# EAGLE design DasAltimeter V0.1 (EAGLE 8.5.0)
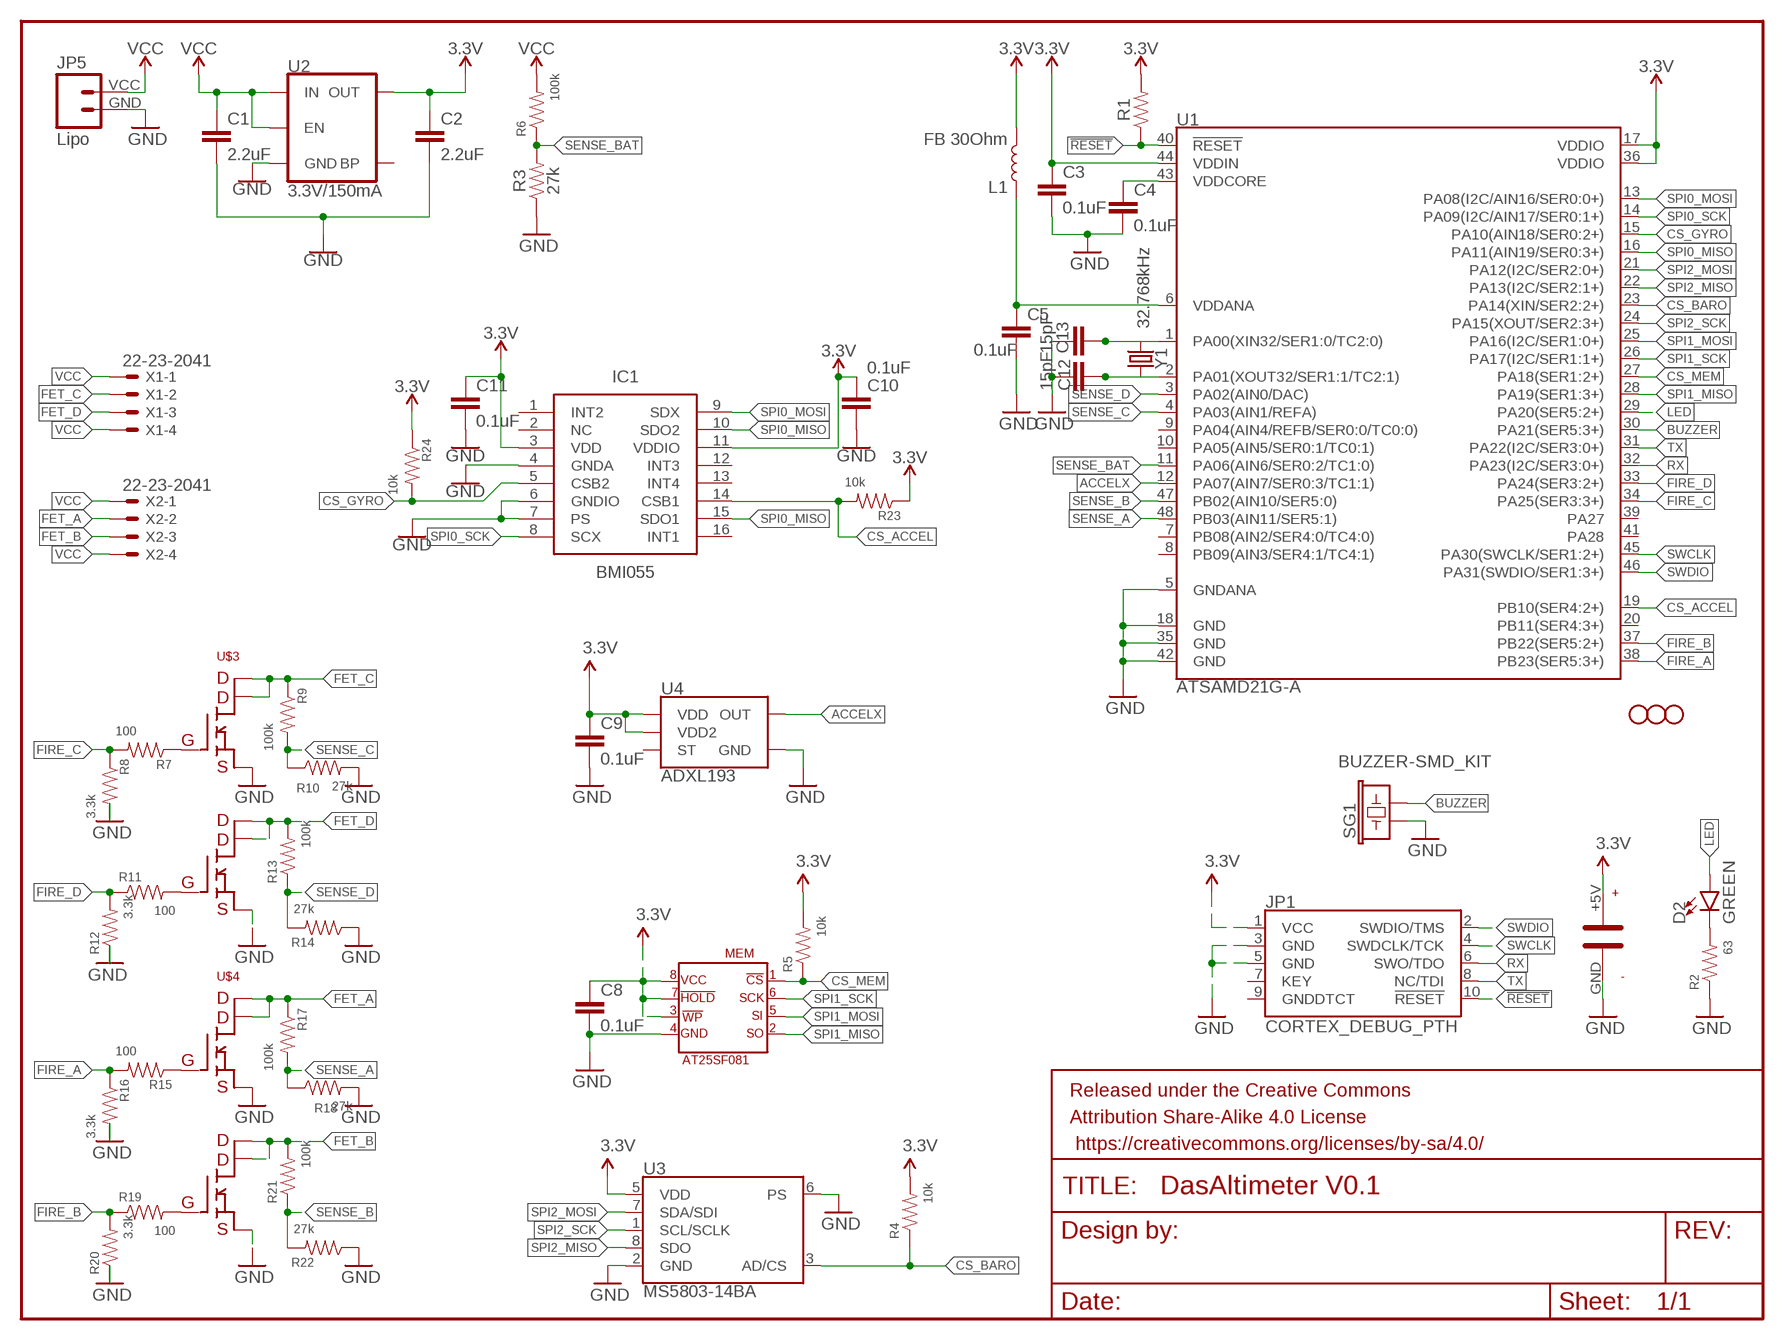
[diagram p0: schematic, sheet 1]

## Parts
C1  2.2uF  2.2UF-0603-10V-20%  [0603]
C2  2.2uF  2.2UF-0603-10V-20%  [0603]
C3  0.1uF  0.1UF-0402-16V-10%  [0402]
C4  0.1uF  0.1UF-0402-16V-10%  [0402]
C5  0.1uF  0.1UF-0402-16V-10%  [0402]
C8  0.1uF  0.1UF-0402-16V-10%  [0402]
C9  0.1uF  0.1UF-0402-16V-10%  [0402]
C10  0.1uF  0.1UF-0402-16V-10%  [0402]
C11  0.1uF  0.1UF-0402-16V-10%  [0402]
C12  15pF  15PF-0402-50V-5%  [0402]
C13  15pF  15PF-0402-50V-5%  [0402]
D2  GREEN  LED-GREEN1206  [LED-1206]
FRAME1  FRAME-LETTERNO_PACKAGE  [DUMMY]
H1  STAND-OFFTIGHT  [STAND-OFF-TIGHT]
H2  STAND-OFFTIGHT  [STAND-OFF-TIGHT]
H3  STAND-OFFTIGHT  [STAND-OFF-TIGHT]
IC1  BMI055  [BMI055]
JP1  CORTEX_DEBUG_PTH  [2X5-PTH-1.27MM]
JP5  Lipo  M024UCON-15767  [JST-2-SMD-VERT]
L1  FB 30Ohm  INDUCTOR-0603-33NH  [0603]
MEM  AT25SF081  [AT25SF081]
R1  RESISTOR0402  [0402]
R2  63  RESISTOR0402  [0402]
R3  27k  RESISTOR0402  [0402]
R4  10k  RESISTOR0402  [0402]
R5  10k  RESISTOR0402  [0402]
R6  100k  RESISTOR0402  [0402]
R7  100  RESISTOR0402  [0402]
R8  3.3k  RESISTOR0402  [0402]
R9  100k  RESISTOR0402  [0402]
R10  27k  RESISTOR0402  [0402]
R11  100  RESISTOR0402  [0402]
R12  3.3k  RESISTOR0402  [0402]
R13  100k  RESISTOR0402  [0402]
R14  27k  RESISTOR0402  [0402]
R15  100  RESISTOR0402  [0402]
R16  3.3k  RESISTOR0402  [0402]
R17  100k  RESISTOR0402  [0402]
R18  27k  RESISTOR0402  [0402]
R19  100  RESISTOR0402  [0402]
R20  3.3k  RESISTOR0402  [0402]
R21  100k  RESISTOR0402  [0402]
R22  27k  RESISTOR0402  [0402]
R23  10k  RESISTOR0402  [0402]
R24  10k  RESISTOR0402  [0402]
SG1  BUZZER-SMD_KIT  [BUZZER-CCV-KIT]
U1  ATSAMD21G-A  [TQFP-48]
U2  3.3V/150mA  V_REG_MIC52053.3V  [SOT23-5]
U3  MS5803-14BA  [MS5803]
U4  ADXL193  [LCC-8]
U$1  PB-5R0H104-R  [PB-5R0H104-R]
U$3  SI7232DN  [SI7232DN]
U$4  SI7232DN  [SI7232DN]
X1  22-23-2041  [22-23-2041]
X2  22-23-2041  [22-23-2041]
Y1  32.768kHz  CRYSTAL-32.768KHZSMD-3.2X1.5  [CRYSTAL-SMD-3.2X1.5MM]

## Nets
3.3V: C2.1 C3.1 C8.1 C9.1 C10.1 C11.1 IC1.3(VDD) IC1.11(VDDIO) JP1.1(VCC) L1.2 MEM.!HOLD MEM.!WP MEM.VCC R1.2 R4.2 R5.2 R23.1 R24.1 U1.17(VDDIO) U1.36(VDDIO) U1.44(VDDIN) U2.5(OUT) U3.5(VDD) U4.P$7(VDD) U4.P$8(VDD2) U$1.+5V
!RESET: JP1.10(!RESET) R1.1 U1.40(!RESET!)
ACCELX: U1.12(PA07(AIN7/SER0:3/TC1:1)) U4.P$6(OUT)
BUZZER: SG1.- U1.30(PA21(SER5:3+))
CS_ACCEL: IC1.14(CSB1) R23.2 U1.19(PB10(SER4:2+))
CS_BARO: R4.1 U1.23(PA14(XIN/SER2:2+)) U3.3(AD/CS)
CS_GYRO: IC1.5(CSB2) R24.2 U1.15(PA10(AIN18/SER0:2+))
CS_MEM: MEM.!CS R5.1 U1.27(PA18(SER1:2+))
FET_A: R17.1 U$4.7(PIN7) U$4.8(PIN8) U$4.9(PIN8) X2.2
FET_B: R21.2 U$4.5(PIN5) U$4.6(PIN6) U$4.10(PIN5) X2.3
FET_C: R9.1 U$3.7(PIN7) U$3.8(PIN8) U$3.9(PIN8) X1.2
FET_D: R13.2 U$3.5(PIN5) U$3.6(PIN6) U$3.10(PIN5) X1.3
FIRE_A: R15.2 R16.1 U1.38(PB23(SER5:3+))
FIRE_B: R19.1 R20.2 U1.37(PB22(SER5:2+))
FIRE_C: R7.2 R8.1 U1.34(PA25(SER3:3+))
FIRE_D: R11.1 R12.2 U1.33(PA24(SER3:2+))
GND: C1.2 C2.2 C3.2 C4.2 C5.2 C8.2 C9.2 C10.2 C11.2 C12.1 C13.1 IC1.4(GNDA) IC1.6(GNDIO) IC1.7(PS) JP1.3(GND) JP1.5(GND) JP5.GND MEM.GND R2.1 R3.1 R8.2 R10.2 R12.1 R14.1 R16.2 R18.2 R20.1 R22.1 SG1.+ U1.5(GNDANA) U1.18(GND) U1.35(GND) U1.42(GND) U2.2(GND) U3.2(GND) U3.6(PS) U4.P$3(GND) U$1.GND U$3.1(PIN1) U$3.3(PIN3) U$4.1(PIN1) U$4.3(PIN3)
LED: D2.A U1.29(PA20(SER5:2+))
N$1: R7.1 U$3.2(PIN2)
N$3: C4.1 U1.43(VDDCORE)
N$4: C5.1 L1.1 U1.6(VDDANA)
N$5: C13.2 U1.1(PA00(XIN32/SER1:0/TC2:0)) Y1.P$2
N$6: C12.2 U1.2(PA01(XOUT32/SER1:1/TC2:1)) Y1.P$1
N$8: R11.2 U$3.4(PIN4)
N$12: R15.1 U$4.2(PIN2)
N$13: R19.2 U$4.4(PIN4)
N$29: D2.C R2.2
RX: JP1.6(SWO/TDO) U1.32(PA23(I2C/SER3:0+))
SENSE_A: R17.2 R18.1 U1.48(PB03(AIN11/SER5:1))
SENSE_B: R21.1 R22.2 U1.47(PB02(AIN10/SER5:0))
SENSE_BAT: R3.2 R6.1 U1.11(PA06(AIN6/SER0:2/TC1:0))
SENSE_C: R9.2 R10.1 U1.4(PA03(AIN1/REFA))
SENSE_D: R13.1 R14.2 U1.3(PA02(AIN0/DAC))
SPI0_MISO: IC1.10(SDO2) IC1.15(SDO1) U1.16(PA11(AIN19/SER0:3+))
SPI0_MOSI: IC1.9(SDX) U1.13(PA08(I2C/AIN16/SER0:0+))
SPI0_SCK: IC1.8(SCX) U1.14(PA09(I2C/AIN17/SER0:1+))
SPI1_MISO: MEM.SO U1.28(PA19(SER1:3+))
SPI1_MOSI: MEM.SI U1.25(PA16(I2C/SER1:0+))
SPI1_SCK: MEM.SCK U1.26(PA17(I2C/SER1:1+))
SPI2_MISO: U1.22(PA13(I2C/SER2:1+)) U3.8(SDO)
SPI2_MOSI: U1.21(PA12(I2C/SER2:0+)) U3.7(SDA/SDI)
SPI2_SCK: U1.24(PA15(XOUT/SER2:3+)) U3.1(SCL/SCLK)
SWCLK: JP1.4(SWDCLK/TCK) U1.45(PA30(SWCLK/SER1:2+))
SWDIO: JP1.2(SWDIO/TMS) U1.46(PA31(SWDIO/SER1:3+))
TX: JP1.8(NC/TDI) U1.31(PA22(I2C/SER3:0+))
VCC: C1.1 JP5.VCC R6.2 U2.1(IN) U2.3(EN) X1.1 X1.4 X2.1 X2.4
Unconnected: IC1.1(INT2) IC1.2(NC) IC1.12(INT3) IC1.13(INT4) IC1.16(INT1) JP1.7(KEY) JP1.9(GNDDTCT) U1.7(PB08(AIN2/SER4:0/TC4:0)) U1.8(PB09(AIN3/SER4:1/TC4:1)) U1.9(PA04(AIN4/REFB/SER0:0/TC0:0)) U1.10(PA05(AIN5/SER0:1/TC0:1)) U1.20(PB11(SER4:3+)) U1.39(PA27) U1.41(PA28) U2.4(BP) U4.P$4(ST)

## Library data of the parts
C1 C2 = SparkFun-Capacitors:2.2UF: 2.2µF ceramic capacitors A capacitor is a passive two-terminal electrical component used to store electrical energy temporarily in an electric field.; PROD_ID: CAP-07888
C3-C5 C8-C11 = SparkFun-Capacitors:0.1UF: 0.1µF ceramic capacitors A capacitor is a passive two-terminal electrical component used to store electrical energy temporarily in an electric field.; PROD_ID: CAP-12416
C12 C13 = SparkFun-Capacitors:15PF: 15pF ceramic capacitors A capacitor is a passive two-terminal electrical component used to store electrical energy temporarily in an electric field.; PROD_ID: CAP-13063
D2 = SparkFun-LED:LED-GREEN: Green SMD LED Used in manufacturing of various products at SparkFun Packages: 0603 - SMD 0603 package [Product Link] <http://www.futureelectronics.com/en/technologies/semiconductors/optoelectronics/leds/Pages/9894312-LTST-C190GKT.aspx?CrossPart=HSMG-C190&IM=0> LilyPad 1206 - SMD1206 LilyPad package [Product Link] <http://www.futureelectronics.com/en/Technologies/Product.aspx?ProductID=IN150NGHARVATEKCORPORATION2049943&IM=0> 1206 - SMD1206 package [Product Link] <http://www.futureelectronics.com/en/technologies/semiconductors/optoelectronics/leds/Pages/8315665-LTST-C150KGKT.aspx?IM=0> 1206 Bottom Mount -SMD 1206 Bottom Mount [Product Link] <http://www.digikey.com/product-detail/en/lite-on-inc/LTST-C230KGKT/160-1456-1-ND/386854> SparkFun Products: Pro Mini 328 -5V <https://www.sparkfun.com/products/821> RedBoard <https://www.sparkfun.com/products/12757> MP3 Trigger <https://www.sparkfun.com/products/13720> Makey Makey <https://www.sparkfun.com/products/11076>; PROD_ID: DIO-00862
FRAME1 = SparkFun-Aesthetics:FRAME-LETTER: Schematic Frame - Letter Standard 8.5x11 US Letter frame; DESIGNER: Nobody; VERSION: v01
H1-H3 = SparkFun-Hardware:STAND-OFF: Stand Off Drill holes for mechanically mounting via screws, standoffs, etc. Note: Use the keepout ring to avoid running the screw head into surrounding components. Variant Overviews STAND-OFF - Mechanical footprint for a #4 phillips button head screw. STAND-OFF-TIGHT - Mechanical footprint for a #4 phillips button head screw, Example SparkFun Products Screw - Phillips Head (1/4", 4-40, 10 pack) <https://www.sparkfun.com/products/10453> (PRT-10453) Screw - Phillips Head (1/2", 4-40, 10 pack) <https://www.sparkfun.com/products/10452> (PRT-10452) Screw - Phillips Head (3/4", 4-40, 10 pack) <https://www.sparkfun.com/products/10451> (PRT-10451) Screw - Phillips Head (1", 4-40, 10 pack) <https://www.sparkfun.com/products/10450> (PRT-10450)
IC1 = BMI055:BMI055: IMUs - Inertial Measurement Units 6-Axis Inertia 3x4.5mm LGA-16 <https://componentsearchengine.com/Images/1/BMI055.jpg> Source: Datasheet <https://ae-bst.resource.bosch.com/media/_tech/media/datasheets/BST-BMI055-DS000-08.pdf>; DESCRIPTION: IMUs - Inertial Measurement Units 6-Axis Inertia 3x4.5mm LGA-16; HEIGHT: mm; MANUFACTURER_NAME: Bosch Sensortec; MANUFACTURER_PART_NUMBER: BMI055; SUPPLIER_NAME: RS
JP1 = SparkFun-Connectors:CORTEX_DEBUG: Cortex Debug Connector - 10 pin Supports JTAG debug, Serial Wire debug, and Serial Wire Viewer. PTH and SMD connector options available. General Connector Information <http://infocenter.arm.com/help/topic/com.arm.doc.faqs/attached/13634/cortex_debug_connectors.pdf> Products: PTH Connector <http://www.digikey.com/product-detail/en/cnc-tech/3220-10-0100-00/1175-1627-ND/3883661> -via Digi-Key SparkFun PSoc <https://www.sparkfun.com/products/13229> SparkFun T <https://www.sparkfun.com/products/13810>
JP5 = SparkFun-Connectors:M02: Standard 2-pin 0.1" header. Use with - straight break away headers ( PRT-00116) - right angle break away headers (PRT-00553) - swiss pins (PRT-00743) - machine pins (PRT-00117) - female headers (PRT-00115) Molex polarized connector foot print use with: PRT-08233 with associated crimp pins and housings. 2.54_SCREWTERM for use with PRT-10571. 3.5mm Screw Terminal footprints for PRT-08084 5mm Screw Terminal footprints for use with PRT-08432
L1 = SparkFun-Coils:INDUCTOR: Inductors Resist changes in electrical current. Basically a coil of wire. SparkFun Products: SparkFun Load Cell Amplifier - HX711 <https://www.sparkfun.com/products/13879> IOIO-OTG - V2.2 <https://www.sparkfun.com/products/13613>; PROD_ID: NDUC-07874; VALUE: 33nH/±5%/500mA
MEM = SaL-lib:AT25SF081: AT25SF081 - 8M memory smd
R1-R24 = SparkFun-Resistors:RESISTOR: Generic Resistor Package
SG1 = SparkFun-Electromechanical:BUZZER: Buzzer Small round buzzers that operate around the audible 2kHz range. You can use these as speakers to create simple music or user interfaces. Variant Overview: PTH - Mini Speaker - PC Mount 12mm 2.048kHz <https://www.sparkfun.com/products/7950> PTH_KIT - Mini Speaker - PC Mount 12mm 2.048kHz <https://www.sparkfun.com/products/7950> KIT simplifies soldering by adding stop mask to one side of the pads. PTH_NO_SILK - Mini Speaker - PC Mount 12mm 2.048kHz <https://www.sparkfun.com/products/7950> No silkscreen indicator of buzzer outline. PTH_KIT_NO_SILK - Mini Speaker - PC Mount 12mm 2.048kHz <https://www.sparkfun.com/products/7950> KIT package w/o silkscreen SMD - Buzzer Audio Magnetic (CCV-084B16) SMD buzzer used on, e.g. the LilyPad Buzzer <https://www.sparkfun.com/products/8463> and RFID USB Reader <https://www.sparkfun.com/products/9963>. SMD_KIT - Buzzer Audio Magnetic (CCV-084B16) SMD Buzzer with elongated pins to make soldering easier. Used on the SparkFun Simon Says - Surface Mount Soldering Kit <https://www.sparkfun.com/products/10935>.; PROD_ID: COMP-08568
U1 = SparkFun-IC-Microcontroller:ATSAMD21G: Atmel SAMD21G SMART ARM-Based Microcontroller The Atmel ® | SMART ™ SAM D21 is a series of low-power microcontrollers using the 32-bit ARM ® Cortex ® -M0+ processor, and ranging from 32- to 64-pins with up to 256KB Flash and 32KB of SRAM. The SAM D21 devices operate at a maximum frequency of 48MHz and reach 2.46 CoreMark/MHz. They are designed for simple and intuitive migration with identical peripheral modules, hex compatible code, identical linear address map and pin compatible migration paths between all devices in the product series. All devices include intelligent and flexible peripherals, Atmel Event System for inter-peripheral signaling, and support for capacitive touch button, slider and wheel user interfaces. Datasheet <https://cdn.sparkfun.com/datasheets/Dev/Arduino/Boards/Atmel-42181-SAM-D21_Datasheet.pdf> SparkFun Products SparkFun SAMD21 Mini Breakout <https://www.sparkfun.com/products/13664> (DEV-13664) SparkFun SAMD21 Dev Breakout <https://www.sparkfun.com/products/13672> (DEV-13672); PROD_ID: IC-13064
U2 = SparkFun-IC-Power:V_REG_MIC5205: V_REG MIC5205 Standard 3.3V, 5V, and Adjustable 150mA LDO voltage regulator in SOT-23 layout. Micrel part MIC5205. BP (by-pass) pin is used to lower output noise with 470pF cap, may be left open. On the adjustable version BP is used to set output.; PROD_ID: VREG-00822
U3 = SparkFun-Sensors:MS5803-14BA: Measurement Specialties MS5803_14BA Pressure (Depth) Sensor The MS5803-14BA is a new generation of high resolution pressure sensors with SPI and I2C bus interface. It is optimized for depth measurement systems with a water depth resolution of 1cm and below. The sensor module includes a high linear pressure sensor and an ultra low power 24 bit ΔΣ ADC with internal factory calibrated coefficients. It provides a precise digital 24 Bit pressure and temperature value and different operation modes that allow the user to optimize for conversion speed and current consumption. Datasheet <https://cdn.sparkfun.com/datasheets/Sensors/Weather/ms5803_14ba.pdf> SparkFun Products SparkFun Pressure Sensor Breakout - MS5803-14BA <https://www.sparkfun.com/products/12909> (SEN-12909); PROD_ID: IC-12111
U4 = SparkFun-Sensors:ADXL193: Analog Devices ADXL193 - 250g Accelerometer w/ Analog Output The ADXL193 is a small (5 mm x 5 mm x 2 mm ceramic LCC package), low power (1.5 mA current at 5V), single axis high-g iMEMS® accelerometer designed to sense shock and vibration at g-ranges of ±120g or ±250g. Three models are available and include AD22282-A-R2 (±120g) and AD22283-B-R2 (±250g). These products are used in a variety of crash/impact detection applications which include automotive airbag crash detection systems as well as medical, industrial, and sports equipment. Datasheet <https://www.sparkfun.com/datasheets/Sensors/Accelerometer/ADXL193.pdf> SparkFun Products SparkFun Single Axis Accelerometer Breakout - ADXL193 (+/-250g) <https://www.sparkfun.com/products/9332> (SEN-09332); PROD_ID: IC-09219
U$1 = SaL-lib1:PB-5R0H104-R
U$3 U$4 = SaL-lib1:SI7232DN: SI7232DN dual
X1 X2 = con-molex:22-23-2041: .100" (2.54mm) Center Header - 4 Pin; MF: MOLEX; MPN: 22-23-2041; OC_FARNELL: 1462920; OC_NEWARK: 38C0355
Y1 = SparkFun-Clocks:CRYSTAL-32.768KHZ: 32.768kHz Crystal Frequency: 32.768kHz Frequency Stability: ±20ppm Load Capacitance: 12.5pF (PTH-2X6 & SMD-3.2X1.5), 6pF (SMD-2X6) SparkFun Products: SparkFun BigTime Watch Kit <https://www.sparkfun.com/products/11734> SparkFun nRF52832 Breakout <https://www.sparkfun.com/products/13990> SparkFun Real Time Clock Module <https://www.sparkfun.com/products/12708>; PROD_ID: XTAL-13062

## Board
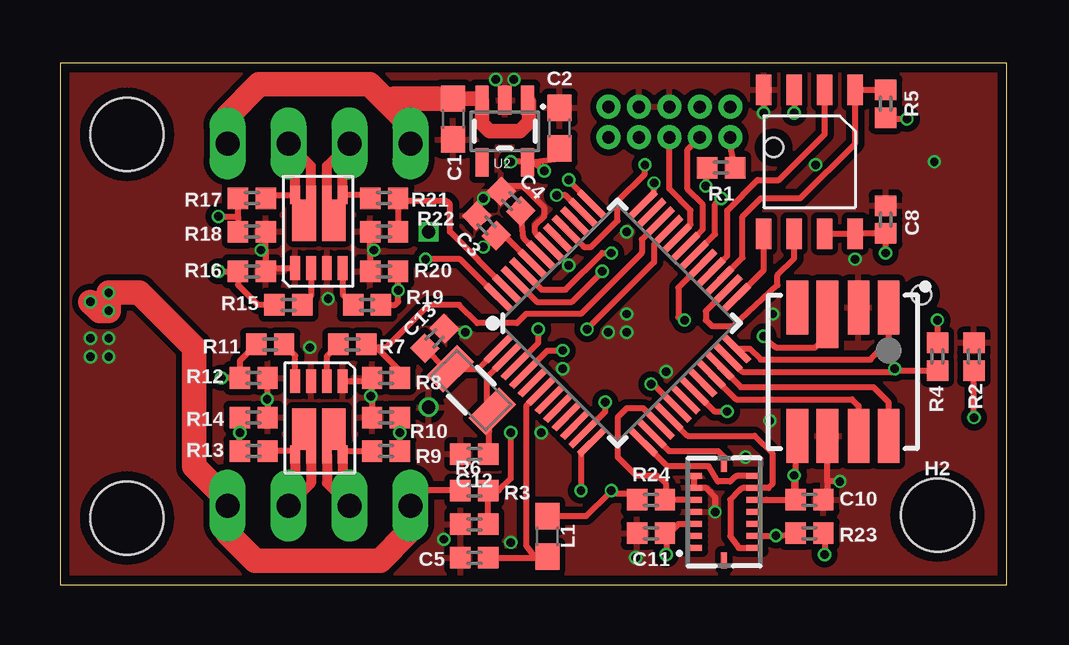
[diagram p1: board, top side]
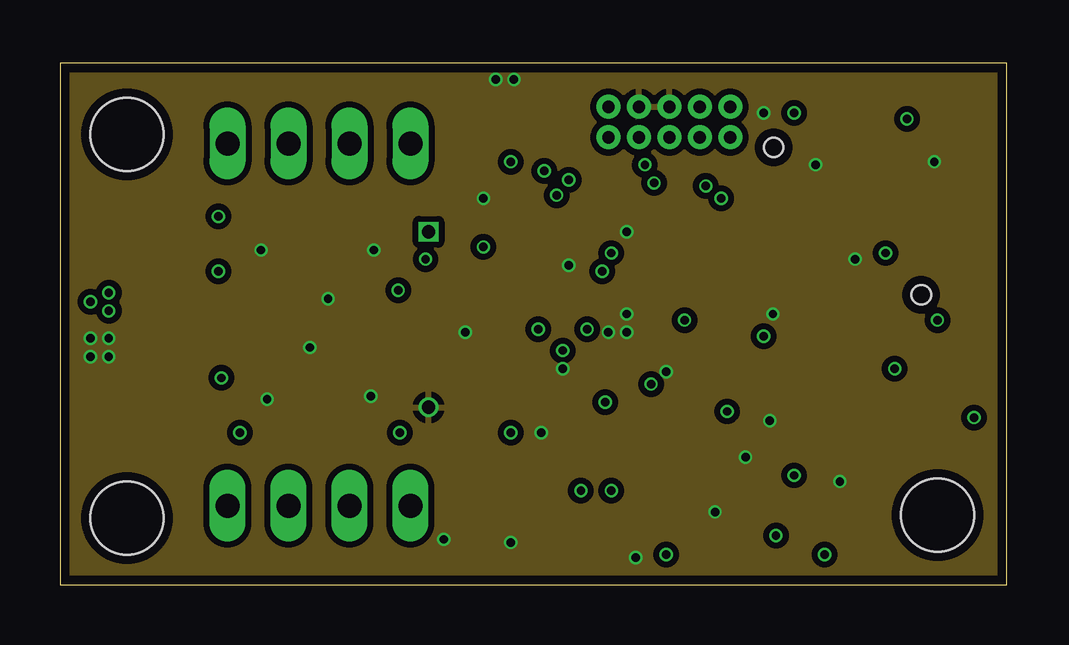
[diagram p2: board, inner layer Route2]
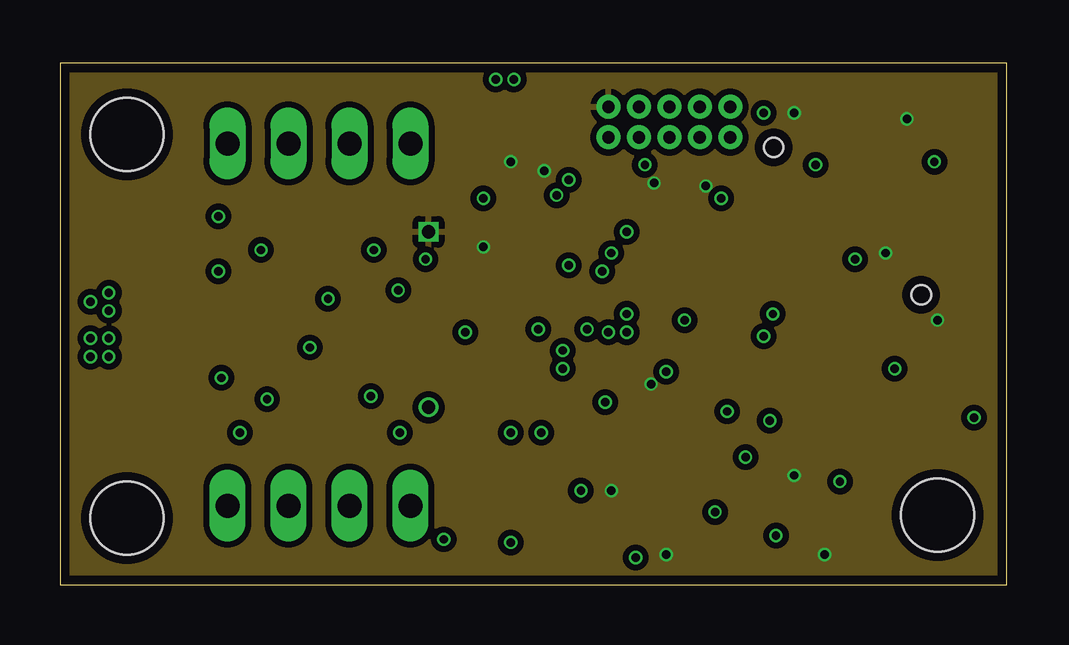
[diagram p3: board, inner layer Route15]
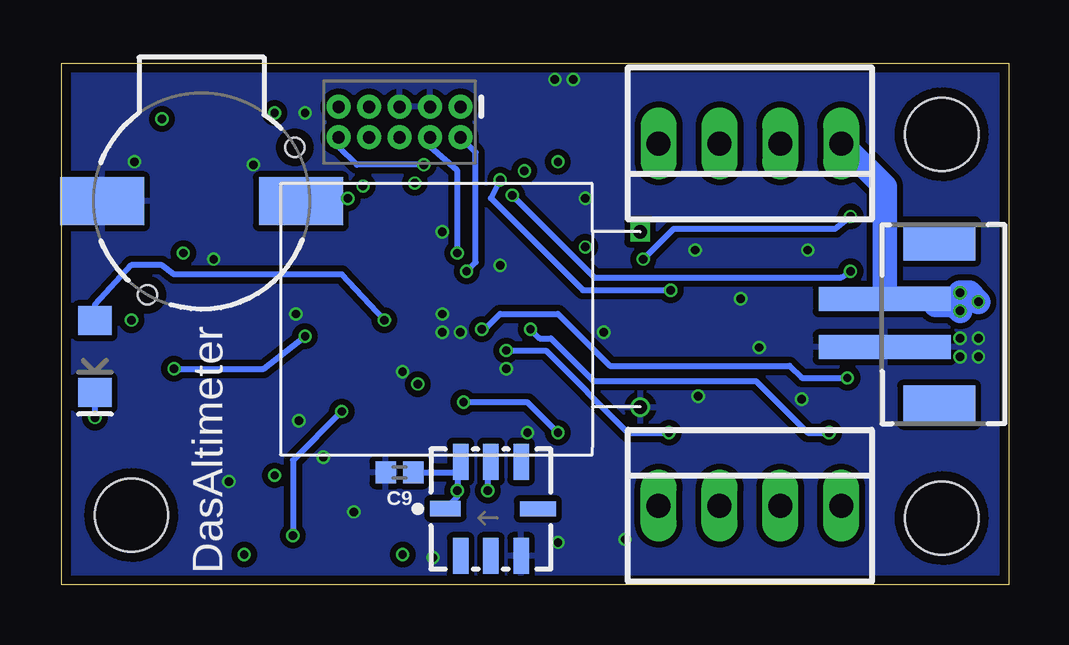
[diagram p4: board, bottom side, seen from below]

Size 39.48 x 21.77 mm. Coordinates in mm from the lower left corner, seen from the top.
Outline: 0,0 39.48,0 39.48,21.77 0,21.77 0,0
Copper layers (1*2*15*16): Top 0.035559375mm / dielectric 0.17018125mm / Route2 0.01778125mm / dielectric 47mil / Route15 0.01778125mm / dielectric 0.17018125mm / Bottom 0.035559375mm
Design rules "oshpark-4layer-tented *": minimum track width 5mil, minimum drill 10mil, track to track 10mil, track to pad 5mil, pad to pad 5mil, via to via 5mil, smd to smd 5mil, copper to edge 15mil, drill to drill 6mil, minimum pad ring 4mil, minimum via ring 4mil, stop-mask expansion 2.5mil, vias tented up to drill 20mil, thermal gap 10mil

### Footprints (pad centres in the part's own frame; a part is rotated, then mirrored left to right if it is on the bottom)
0603 = smd 1.1 x 1: 1 -0.85,0; 2 0.85,0
0402 = smd 0.85 x 0.9: 1 -0.58,0; 2 0.58,0
LED-1206 = smd 1.2 x 1.4: A -1.5,0; C 1.5,0
STAND-OFF-TIGHT = hole 3.048: 0,0
BMI055 = smd 0.675 x 0.25: 1 1.262,1.5; 2 1.262,1; 3 1.262,0.5; 4 1.262,0; 5 1.262,-0.5; 6 1.262,-1; 7 1.262,-1.5; 9 -1.262,-1.5; 10 -1.262,-1; 11 -1.262,-0.5; 12 -1.262,0; 13 -1.262,0.5; 14 -1.262,1; 15 -1.262,1.5 | smd 0.25 x 0.675: 8 0,-2.013; 16 0,2.013
2X5-PTH-1.27MM = drill 0.508 pad 1: 1 -2.54,-0.635; 2 -2.54,0.635; 3 -1.27,-0.635; 4 -1.27,0.635; 5 0,-0.635; 6 0,0.635; 7 1.27,-0.635; 8 1.27,0.635; 9 2.54,-0.635; 10 2.54,0.635
JST-2-SMD-VERT = smd 1 x 5.5: GND 1,-2; VCC -1,-2 | smd 1.6 x 3: P$1 -3.4,0.27; P$2 3.4,0.27
AT25SF081 = smd 1.27 x 0.635: !CS -3,2.54; !HOLD 3,1.27; !WP -3,0; GND -3,-1.27; SCK 3,0; SI 3,-1.27; SO -3,1.27; VCC 3,2.54
BUZZER-CCV-KIT = smd 3.5 x 2: + 4.15,0; - -4.15,0 | hole 0.8: -3.9,-2.25; 2.25,3.9
TQFP-48 = smd 1.5 x 0.28: 1 -4.25,2.75; 2 -4.25,2.25; 3 -4.25,1.75; 4 -4.25,1.25; 5 -4.25,0.75; 6 -4.25,0.25; 7 -4.25,-0.25; 8 -4.25,-0.75; 9 -4.25,-1.25; 10 -4.25,-1.75; 11 -4.25,-2.25; 12 -4.25,-2.75; 25 4.25,-2.75; 26 4.25,-2.25; 27 4.25,-1.75; 28 4.25,-1.25; 29 4.25,-0.75; 30 4.25,-0.25; 31 4.25,0.25; 32 4.25,0.75; 33 4.25,1.25; 34 4.25,1.75; 35 4.25,2.25; 36 4.25,2.75 | smd 0.28 x 1.5: 13 -2.75,-4.25; 14 -2.25,-4.25; 15 -1.75,-4.25; 16 -1.25,-4.25; 17 -0.75,-4.25; 18 -0.25,-4.25; 19 0.25,-4.25; 20 0.75,-4.25; 21 1.25,-4.25; 22 1.75,-4.25; 23 2.25,-4.25; 24 2.75,-4.25; 37 2.75,4.25; 38 2.25,4.25; 39 1.75,4.25; 40 1.25,4.25; 41 0.75,4.25; 42 0.25,4.25; 43 -0.25,4.25; 44 -0.75,4.25; 45 -1.25,4.25; 46 -1.75,4.25; 47 -2.25,4.25; 48 -2.75,4.25
SOT23-5 = smd 0.55 x 1.2: 1 -0.95,-1.3; 2 0,-1.3; 3 0.95,-1.3; 4 0.95,1.3; 5 -0.95,1.3
MS5803 = smd 2.25 x 0.9: 1 -2.675,1.9; 2 -2.675,0.65; 4 -2.675,-1.9; 5 2.675,-1.9; 6 2.675,-0.65; 7 2.675,0.65; 8 2.675,1.9 | smd 2.8 x 0.9: 3 -2.4,-0.65
LCC-8 = smd 1.5 x 0.64: P$1 -1.96,1.26; P$2 -1.96,0; P$3 -1.96,-1.26; P$5 1.96,-1.26; P$6 1.96,0; P$7 1.96,1.26 | smd 0.64 x 1.5: P$4 0,-1.96 | smd 0.64 x 1.27: P$8 0.01,1.9
PB-5R0H104-R = drill 0.55 square: +5V 0,0 | drill 0.55: GND 0,7.32
SI7232DN = smd 0.991 x 0.406: 1 -1.13,0.991; 2 -1.13,0.33; 3 -1.13,-0.33; 4 -1.13,-0.991 | smd 0.762 x 0.406: 5 1.918,-0.991; 6 1.918,-0.33; 7 1.918,0.33; 8 1.918,0.991 | smd 1.727 x 0.991: 9 0.864,0.622; 10 0.864,-0.622
22-23-2041 = drill 1 long: 1 -3.81,0; 2 -1.27,0; 3 1.27,0; 4 3.81,0
CRYSTAL-SMD-3.2X1.5MM = smd 1 x 1.8: P$1 -1.25,0; P$2 1.25,0

### Placement (x,y rotation side)
C1  16.38,19.43 270 top
C2  20.83,19.05 90 top
C3  17.78,14.99 135 top
C4  18.8,16 135 top
C5  17.27,1.14 180 top
C8  34.42,15.24 90 top
C9  25.4,4.7 180 bottom
C10  31.24,3.56 0 top
C11  24.64,2.16 180 top
C12  17.27,5.46 0 top
C13  15.62,10.29 225 top
D2  38.1,9.53 270 bottom
FRAME1  -24.13,48.26 0 top  (outside the outline)
H1  2.79,18.8 0 top
H2  36.58,2.92 0 top
H3  2.79,2.79 0 top
IC1  27.69,3.05 180 top
JP1  25.4,19.3 180 bottom
JP5  3.17,10.92 270 bottom
L1  20.32,2.03 90 top
MEM  30.61,17.65 270 top
R1  27.56,17.4 180 top
R2  38.1,9.53 270 top
R3  17.27,2.54 0 top
R4  36.58,9.53 90 top
R5  34.42,20.07 270 top
R6  17.27,3.94 180 top
R7  12.19,10.03 0 top
R8  13.59,8.64 180 top
R9  13.59,5.59 0 top
R10  13.59,6.99 180 top
R11  8.76,10.03 0 top
R12  8.08,8.64 180 top
R13  8.08,5.59 0 top
R14  8.08,6.99 180 top
R15  9.53,11.68 180 top
R16  8,13.08 0 top
R17  8,16.13 180 top
R18  8,14.73 0 top
R19  12.8,11.68 180 top
R20  13.51,13.08 0 top
R21  13.51,16.13 180 top
R22  13.51,14.73 0 top
R23  31.24,2.16 180 top
R24  24.64,3.56 0 top
SG1  33.66,16 180 bottom
U1  23.24,10.92 45 top
U2  18.54,18.92 180 top
U3  32.64,8.89 270 top
U4  21.59,3.17 90 bottom
U$1  15.37,14.73 180 bottom
U$3  10.79,7.37 270 top
U$4  10.79,14.35 90 top
X1  10.79,3.3 0 bottom
X2  10.79,18.41 180 bottom
Y1  17.14,8.13 135 top

### Tracks (layer width: path | path; a pad name or v marks a point on that pad's centre or on a via)
3.3V  (via drill 0.35)
  Top 0.254: U1.44 18.65,14.45 C3.1 17.71,14.1 v17.65,14.1 | IC1.3 25.78,2.54 25.4,2.16 C11.1 25.27,2.1 v25.27,1.27 | IC1.11 29.46,3.56 C10.1 | U3.5 30.66,6.14 C10.1 | MEM.!HOLD MEM.VCC 34.29,14.65 | 34.29,14.65 C8.1 | C2.1 20.63,17.75 U2.5 19.39,17.65 | R1.2 26.92,17.22 v26.92,16.64 | U1.36 24.77,16.3 v24.77,16.76 | 19.39,17.65 v18.8,17.65 | v35.31,19.43 34.47,19.43 R5.2 | v34.42,13.84 34.42,14.53 34.29,14.65 | v36.58,11.05 R4.2 | R23.1 31.88,2.1 v31.88,1.27 | L1.2 21.93,2.88 22.86,3.81 | 22.86,3.81 v22.99,3.94 | R24.1 23.8,3.81 22.86,3.81 | U1.17 24.72,8.38 v24.64,8.38 | v20.19,17.27 19.68,17.65 19.39,17.65 | MEM.!WP v30.61,19.68 | C10.1 30.61,3.61 v30.61,4.57
  Bottom 0.254: U4.P$7 22.99,5 22.99,4.7 | 22.99,4.7 v22.99,3.94 22.99,3.69 U4.P$8 | C9.1 22.99,4.7
  pour Route15: -1.27,-1.27 40.64,-1.27 40.64,25.4 -1.27,25.4
!RESET  (via drill 0.35)
  Top 0.254: R1.1 27.89,18.61 JP1.10 | U1.40 21.83,14.1 22.14,14.1 23.24,15.2 23.24,16 24.38,17.14 v24.38,17.53
  Bottom 0.254: v24.38,17.53 27.18,17.53 27.94,18.29 JP1.10
ACCELX  (via drill 0.35)
  Top 0.254: U1.12 21.72,5.51 v21.72,3.94
  Bottom 0.254: v21.72,3.94 21.72,5.01 U4.P$6
BUZZER  (via drill 0.35)
  Top 0.254: U1.30 27.3,14.63 27.3,15.88 v27.56,16.13
  Bottom 0.254: v27.56,16.13 SG1.-
CS_ACCEL  (via drill 0.35)
  Top 0.152: IC1.14
  Top 0.254: R23.2 30.13,2.06 v29.84,2.06 IC1.14 | U1.19 27.28,7.24 v27.81,7.24
  Bottom 0.254: v27.81,7.24 29.84,5.21 v29.84,2.06
CS_BARO  (via drill 0.35)
  Top 0.254: v29.34,10.37 29.34,10.29 29.84,9.91 31.5,9.91 31.88,10.29 31.88,11.15 U3.3 | 34.87,8.95 R4.1 | 34.87,8.95 v34.8,9.02 | U1.23 28.45,8.89 34.81,8.89 34.87,8.95
  Bottom 0.254: v34.8,9.02 31.07,9.02 v29.34,10.37
CS_GYRO
  Top 0.254: U1.15 24.32,7.37 23.62,7.37 23.24,6.99 23.24,5.33 24,4.57 24.89,4.57 25.27,4.19 25.27,3.61 | 25.27,3.61 R24.2 | IC1.5 25.34,3.55 25.27,3.61
CS_MEM
  Top 0.254: U1.27 28.45,13.65 28.45,15.37 29.21,16.13 30.86,16.13 33.15,18.41 MEM.!CS R5.1
FET_A
  Top 0.254: R17.1 8.72,16.27 U$4.8 | U$4.9 10.46,15.51 U$4.7
  Top 0.406: U$4.7 10.46,17.48 X2.2 9.8,18.14 U$4.8
FET_B
  Top 0.254: R21.2 12.79,16.27 U$4.5 | U$4.10 11.12,15.51 U$4.6
  Top 0.406: U$4.6 11.12,17.48 X2.3 11.79,18.14 U$4.5
FET_C
  Top 0.254: R9.1 11.93,5.59 U$3.8 11.79,6.13 U$3.9
  Top 0.406: U$3.8 11.79,3.58 X1.2 11.12,4.24 U$3.7
FET_D
  Top 0.254: 9.66,5.59 R13.2 | 9.66,5.59 U$3.5 | U$3.10 10.17,6.1 9.66,5.59
  Top 0.406: U$3.5 9.8,3.58 X1.3 10.46,4.24 U$3.6
FIRE_A  (via drill 0.35)
  Top 0.254: R15.2 8.26,11.68 7.42,12.52 R16.1 v6.6,13.08 | U1.38 21.08,16.26 v20.7,16.26
  Bottom 0.254: v20.7,16.26 17.27,12.83 6.99,12.83 v6.6,13.08
FIRE_B  (via drill 0.35)
  Top 0.254: R19.1 13.97,11.68 14.1,11.81 v14.1,12.3 14.1,13.33 R20.2 | U1.37 21.21,16.84 v21.21,16.89
  Bottom 0.254: v21.21,16.89 21.59,16.13 17.76,12.3 v14.1,12.3
FIRE_C
  Top 0.254: 13.21,9.91 14.1,9.02 14.1,8.45 R8.1 | R7.2 12.9,9.91 13.21,9.91 | U1.34 24.26,14.41 24.26,13.84 21.72,11.3 19.43,11.3 19.05,10.92 17.4,10.92 16.64,11.68 15.37,11.68 13.59,9.91 13.21,9.91
FIRE_D  (via drill 0.35)
  Top 0.254: U1.33 24.77,14.21 24.77,13.46 v21.97,10.67 | R12.2 | R12.2 v6.73,8.64 | R11.1 7.49,9.34 R12.2
  Bottom 0.254: v21.97,10.67 21.84,10.67 21.21,11.3 18.8,11.3 16.64,9.14 9.14,9.14 8.64,8.64 v6.73,8.64
GND  (via drill 0.35)
  Top 0.254: 8.58,13.97 R18.2 | 8.58,13.97 R16.2 8.7,13.22 U$4.1 | 12.93,13.97 R22.1 | 12.93,13.97 R20.1 | 8.66,7.62 R14.1 | 8.66,7.62 R12.1 | 13.01,7.8 R10.2 | 13.01,7.8 R8.2 12.89,8.5 U$3.1 | 31.82,6.05 U3.6 31.99,4.32 | C10.2 31.99,3.72 31.99,4.32 | U1.42 19.81,14.71 19.81,14.99 20.19,15.37 20.19,15.75 19.3,16.64 18.61,16.64 C4.2 17.65,16.19 v17.65,16.13 17.53,15.93 C3.2 | v8.64,7.75 8.64,7.62 8.66,7.62 | v12.95,7.87 13.01,7.8 | v13.08,13.97 12.93,13.97 | v8.38,13.97 8.58,13.97 | v32.51,4.32 31.99,4.32 | IC1.7 IC1.6 26.44,4.06 26.92,4.06 27.09,3.89 27.11,3.88 27.3,3.68 v27.3,3.05 | MEM.GND v29.34,19.68
  other vias: 18.16,21.08 18.92,21.08 11.18,11.94 10.41,9.91 2.03,10.29 1.27,10.29 2.03,9.53 1.27,9.53 36.45,17.65 33.15,13.59 16,1.91 16.89,10.54 23.62,14.73 23.62,11.3 22.86,10.54 23.62,10.54 20.07,6.35 29.59,6.86 31.5,17.53 29.72,11.3 28.57,5.33 18.8,1.78 24,1.14 25.27,8.89 20.95,9.02 21.21,13.34
  pour Top: -1.27,-1.27 40.64,-1.27 40.64,22.86 -1.27,22.86
  pour Bottom: -1.27,-1.27 40.64,-1.27 40.64,24.13 -1.27,24.13
  pour Route2: -1.27,-1.27 40.64,-1.27 40.64,26.67 -1.27,26.67
LED  (via drill 0.35)
  Top 0.254: U1.29 25.78,12.4 25.78,11.18 25.91,11.05 v26.04,11.05
  Bottom 0.254: v26.04,11.05 27.81,12.95 34.8,12.95 35.31,13.34 36.58,13.34 38.1,11.68 D2.A
N$1
  Top 0.254: U$3.2 11.12,9.55 R7.1
N$3
  Top 0.254: U1.43 19.33,14.48 C4.1
N$4
  Top 0.254: U1.6 19.43,7.47 19.43,1.65 19.77,1.18 L1.1 20.15,1.14 C5.1
N$5
  Top 0.254: U1.1 17.44,9.01 16.51,9.01 | 16.51,9.01 Y1.P$2 | C13.2 16.08,9.01 16.51,9.01
N$6
  Top 0.254: U1.2 17.78,8.64 17.78,7.49 Y1.P$1 17.88,6.63 C12.2
N$8
  Top 0.254: U$3.4 9.8,9.57 R11.2
N$12
  Top 0.254: U$4.2 10.46,12.04 R15.1
N$13
  Top 0.254: U$4.4 11.79,12.12 R19.2
N$29  (via drill 0.35)
  Top 0.254: v38.1,6.99 R2.2
  Bottom 0.254: D2.C v38.1,6.99
RX
  Top 0.254: U1.32 26.29,15.03 26.29,15.62 25.4,16.51 JP1.6
SENSE_A  (via drill 0.35)
  Top 0.254: 7.42,15.37 R17.2 | 7.42,15.37 R18.1 | U1.48 16.68,13.59 v15.24,13.59 | v6.6,15.37 7.42,15.37
  Bottom 0.254: v15.24,13.59 13.97,14.86 7.24,14.86 v6.6,15.37
SENSE_B
  Top 0.254: 14.09,16 R21.1 | 14.09,16 R22.2 | U1.47 16.26,14.73 16.26,15.88 16.13,16 14.09,16
SENSE_BAT  (via drill 0.35)
  Top 0.254: R3.2 R6.1 18.29,3.94 18.8,4.45 v18.8,6.35 | U1.11 22.73,7.23 v22.73,7.62
  Bottom 0.254: v18.8,6.35 20.07,7.62 v22.73,7.62
SENSE_C  (via drill 0.35)
  Top 0.254: R9.2 v14.17,6.35 R10.1 | U1.4 20.32,9.78 v20.95,9.78
  Bottom 0.254: v20.95,9.78 19.3,9.78 15.88,6.35 v14.17,6.35
SENSE_D  (via drill 0.35)
  Top 0.254: R13.1 v7.5,6.35 R14.2 | U1.3 19.94,10.1 v19.94,10.67
  Bottom 0.254: v19.94,10.67 19.56,10.29 19.09,10.29 17.32,8.51 10.54,8.51 8.38,6.35 v7.5,6.35
SPI0_MISO
  Top 0.254: U1.16 26.16,6.22 28.96,6.22 29.72,5.46 29.72,4.23 29.54,4.05 IC1.10 28.45,4.05 28.32,3.94 27.94,3.56 27.94,2.03 28.3,1.55 IC1.15
SPI0_MOSI
  Top 0.254: U1.13 25.32,4.95 27.05,4.95 27.43,4.32 27.94,4.32 28.07,4.45 28.19,4.55 IC1.9
SPI0_SCK
  Top 0.254: U1.14 25.39,5.59 27.43,5.59 27.69,5.33 IC1.8
SPI1_MISO
  Top 0.254: U1.28 27.81,13.73 27.81,15.62 29.08,16.89 29.97,16.89 31.88,18.8 MEM.SO
SPI1_MOSI
  Top 0.254: U1.25 29.34,13.13 MEM.SI
SPI1_SCK
  Top 0.254: U1.26 26.92,11.42 26.92,11.05 27.18,10.79 28.07,10.79 29.91,12.51 29.91,12.92 30.61,13.62 MEM.SCK
SPI2_MISO
  Top 0.254: U1.22 28.38,8.26 33.91,8.26 34.54,7.62 U3.8
SPI2_MOSI
  Top 0.254: U1.21 28.18,7.75 33.02,7.75 33.29,7.48 U3.7
SPI2_SCK
  Top 0.254: U3.1 34.54,10.16 33.78,9.4 29.21,9.4 28.75,9.86 U1.24
SWCLK  (via drill 0.35)
  Top 0.254: U1.45 20.08,12.32 21.08,12.32 22.61,13.84 v22.99,13.84
  Bottom 0.254: v22.99,13.84 22.99,17.27 24.13,18.29 JP1.4
SWDIO  (via drill 0.35)
  Top 0.254: U1.46 19.88,11.81 21.34,11.81 v22.61,13.08
  Bottom 0.254: v22.61,13.08 22.23,13.46 22.23,18.03 JP1.2
TX
  Top 0.254: U1.31 26.8,14.83 26.8,15.88 26.16,16.51 26.16,18.16 JP1.8
VCC  (via drill 0.35)
  Top 0.152: U2.1 19.56,20.16
  Top 0.254: R6.2 15.24,3.94 X1.1
  Top 0.61: 19.56,20.16 19.56,19.3 19.18,18.92 17.91,18.92 17.59,19.24 U2.3 17.53,20.28 C1.1
  Top 1.016: X2.1 6.99,19.56 8.31,20.88 12.9,20.88 13.72,20.07 | X2.4 14.61,19.18 13.72,20.07 | C1.1 13.93,20.28 13.72,20.07 | X1.1 14.48,3.17 14.48,2.16 13.34,1.02 8.13,1.02 6.99,2.16 X1.4 6.99,3.56 5.59,4.95 5.59,9.91 3.3,12.19 v2.03,12.19 v2.03,11.43 1.65,11.43 v1.27,11.81
  Bottom 0.508: v2.03,12.19 4.91,12.19 JP5.VCC
  Bottom 1.016: JP5.VCC 5.17,16.61 X2.1 | v2.03,11.43 2.29,11.68 3.05,11.68 | v1.27,11.81 1.65,12.19 v2.03,12.19

### Text on the board
bNames: DasAltimeter